# Altium schematic sheet PC104.SchDoc
size 297 x 209 mm; SheetNumber: 3; SheetTotal: 4
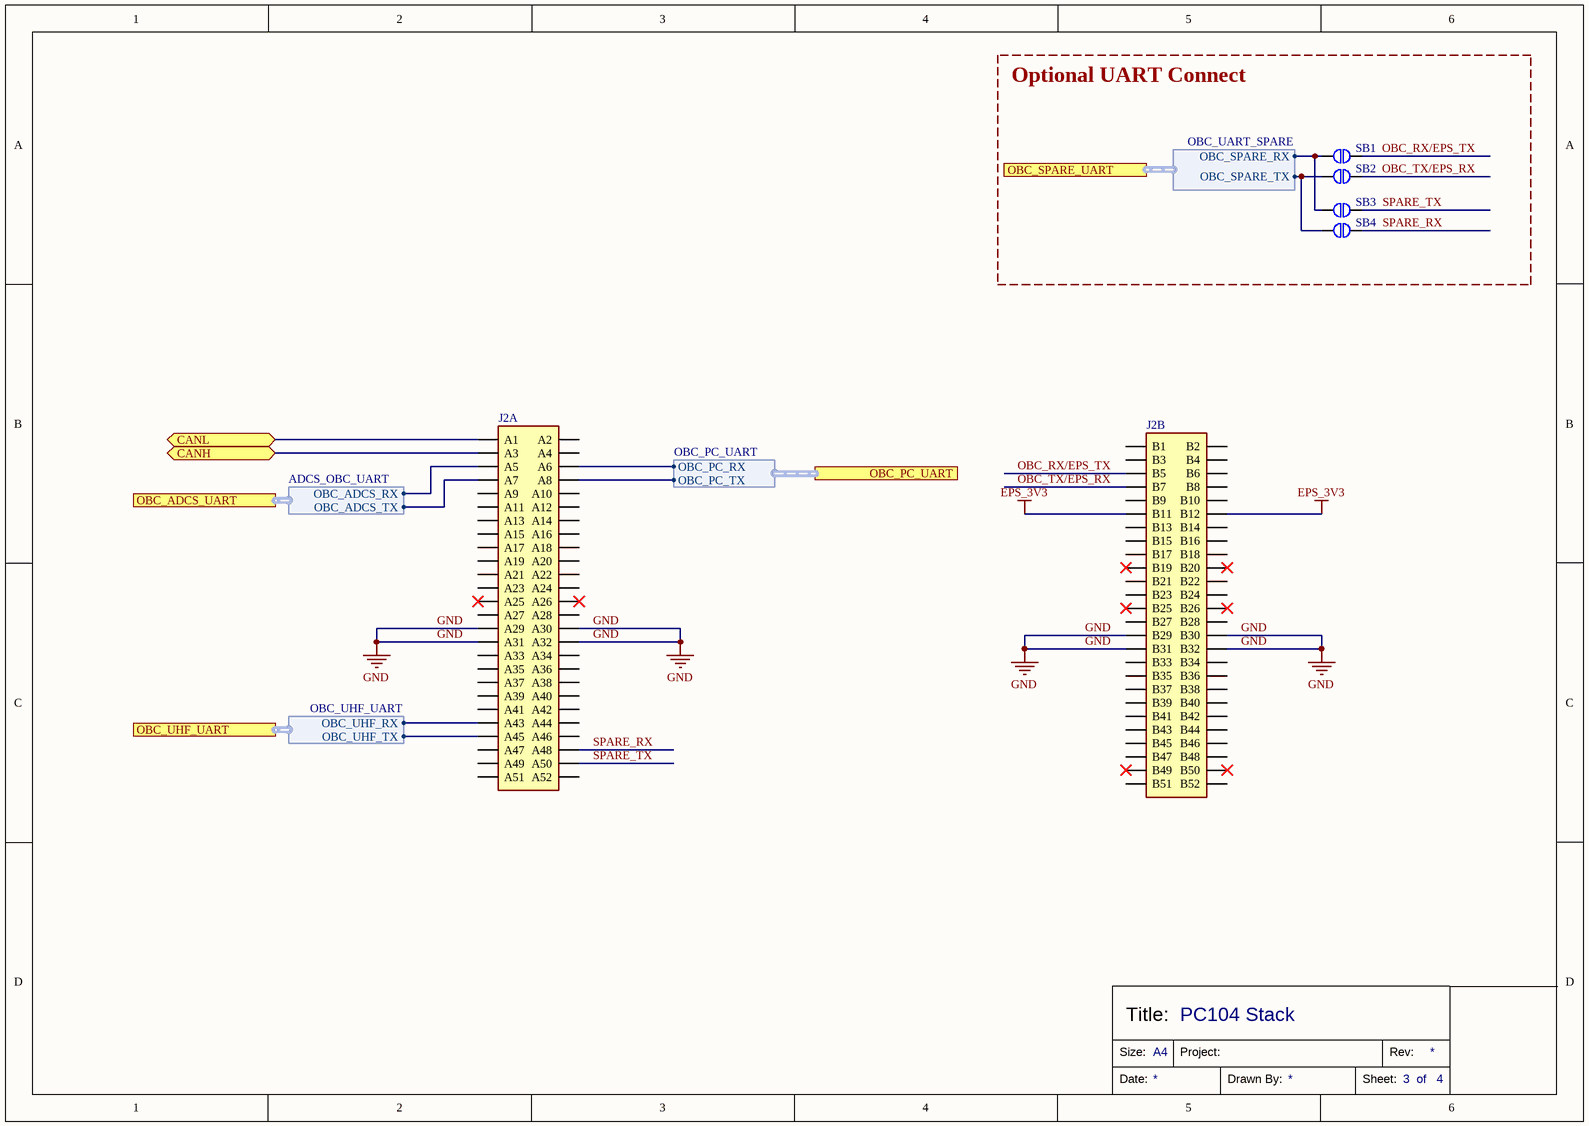
[diagram p0: PC104.SchDoc]

## Parts
J2  SSQ-126-21-G-D  [PC104 STACK HEADER]  (value not drawn)  (parts A,B of 2)
SB1  Solder Bridge Jumper  [Solder Bridge]  (value not drawn)  (no BOM)
SB2  Solder Bridge Jumper  [Solder Bridge]  (value not drawn)  (no BOM)
SB3  Solder Bridge Jumper  [Solder Bridge]  (value not drawn)  (no BOM)
SB4  Solder Bridge Jumper  [Solder Bridge]  (value not drawn)  (no BOM)

## Blocks framed on the sheet
Optional UART Connect: SB1-SB4

## Ports
CANH (bidir, see Controller[6A]), CANL (bidir, see Controller[6A]), OBC_ADCS_UART (harness ADCS_OBC_UART, see Controller[1B]), OBC_PC_UART (harness OBC_PC_UART, see Controller[1B]), OBC_SPARE_UART (harness OBC_UART_SPARE, see Controller[1C]), OBC_UHF_UART (harness OBC_UHF_UART, see Controller[1C])

## Harnesses
ADCS_OBC_UART: OBC_ADCS_TX, OBC_ADCS_RX
OBC_PC_UART: OBC_PC_TX, OBC_PC_RX
OBC_UART_SPARE: OBC_SPARE_TX, OBC_SPARE_RX
OBC_UHF_UART: OBC_UHF_TX, OBC_UHF_RX

## Nets
EPS_3V3: J2.B11 J2.B12
GND: J2.A29 J2.A30 J2.A31 J2.A32 J2.B29 J2.B30 J2.B31 J2.B32
CANH: J2.A3 ; port CANH
CANL: J2.A1 ; port CANL
OBC_RX/EPS_TX: J2.B5 SB1.1
OBC_TX/EPS_RX: J2.B7 SB2.1
SPARE_RX: J2.A48 SB4.1
SPARE_TX: J2.A50 SB3.1
NetJ2_A5: J2.A5 ; port OBC_ADCS_UART.OBC_ADCS_RX
NetJ2_A6: J2.A6 ; port OBC_PC_UART.OBC_PC_RX
NetJ2_A7: J2.A7 ; port OBC_ADCS_UART.OBC_ADCS_TX
NetJ2_A8: J2.A8 ; port OBC_PC_UART.OBC_PC_TX
NetJ2_A43: J2.A43 ; port OBC_UHF_UART.OBC_UHF_RX
NetJ2_A45: J2.A45 ; port OBC_UHF_UART.OBC_UHF_TX
NetSB1_2: SB1.2 SB3.2 ; port OBC_SPARE_UART.OBC_SPARE_RX
NetSB2_2: SB2.2 SB4.2 ; port OBC_SPARE_UART.OBC_SPARE_TX

Not connected (* = marked no-connect by the designer): J2 A2 A4 A9 A10 A11 A12 A13 A14 A15 A16 A17 A18 A19 A20 A21 A22 A23 A24 A25* A26* A27 A28 A33 A34 A35 A36 A37 A38 A39 A40 A41 A42 A44 A46 A47 A49 A51 A52 B1 B2 B3 B4 B6 B8 B9 B10 B13 B14 B15 B16 B17 B18 B19* B20* B21 B22 B23 B24 B25* B26* B27 B28 B33 B34 B35 B36 B37 B38 B39 B40 B41 B42 B43 B44 B45 B46 B47 B48 B49* B50* B51 B52

## Notes on the sheet
- PC104 Stack
- Size:
- Title:
- A4
- Project:
- Rev:
- Date:
- Drawn By:
- Sheet:
- of

## Library data of the parts
J2 = PC104: PC104 stack header, 2.54mm 4x26positions; Current Rating: 6.3A; Number of Positions: 52; Voltage Rating (AC): 465V; Voltage Rating (DC): 655V; Part Number: SSQ-126-21-G-D; Distributor Part Number: SSQ-126-21-G-D-ND; Distributor: Digikey; Operating Temperature: -55°C ~ 125°C; Number of Rows: 2